# Altium project Oasis.PrjPcb
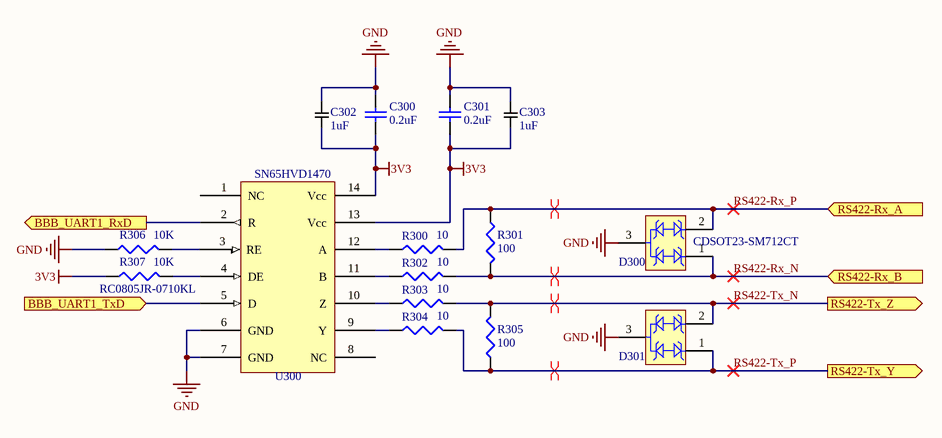
[diagram p0: 300_CDH_RS422.SchDoc]
6 sheets, 142 parts. Net scope: global (net labels, ports and power ports of the same name join across sheets).
Board file: CDH_PCB_reva02.PcbDoc
Sheets:
  300_CDH_RS422.SchDoc
  000_BBB_Pinouts.SchDoc
  100_POWER.SchDoc
  400_TEENSY.SchDoc
  500_HEATERS.SchDoc
  200_CDH_USB_2_Hub.SchDoc

## Sheet 300_CDH_RS422.SchDoc: RS422 Line Driver
size A; DrawnBy: Tyler Sengia; Engineer: Tyler Sengia; Organization: PSU Student Space Projects Lab; Revision: 1

### Parts
C300  value 0.2uF  [IMPERIAL0805_CAPACITOR]  (hidden comment: 0.2uF Capacitor)
C301  value 0.2uF  [IMPERIAL0805_CAPACITOR]  (hidden comment: 0.2uF Capacitor)
C302  value 1uF  [IMPERIAL0603_Capacitor]  (hidden comment: 1 uF Capacitor)
C303  value 1uF  [IMPERIAL0603_Capacitor]  (hidden comment: 1 uF Capacitor)
D300  Other Names: CDSOT23-SM712CT  [BOUR-SOT23-3_V]  (hidden comment: CDSOT23-SM712)
D301  CDSOT23-SM712  [BOUR-SOT23-3_V]  (value not drawn)
R300  value 10  [Imperial1206_RES]  (hidden comment: 10 Ohm Resistor)
R301  value 100  [Imperial0805_RES]  (hidden comment: 100 Ohm Resistor)
R302  value 10  [Imperial1206_RES]  (hidden comment: 10 Ohm Resistor)
R303  value 10  [Imperial1206_RES]  (hidden comment: 10 Ohm Resistor)
R304  value 10  [Imperial1206_RES]  (hidden comment: 10 Ohm Resistor)
R305  value 100  [Imperial0805_RES]  (hidden comment: 100 Ohm Resistor)
R306  value 10K  [Imperial0805_RES]  (hidden comment: RC0805JR-0710KL)
R307  RC0805JR-0710KL  value 10K  [Imperial0805_RES]
U300  Generic Part Number: SN65HVD1470  [SOIC127P590X175-14M]  (hidden comment: SN65HVD1470D)

### Ports
BBB_UART1_RxD (out), BBB_UART1_TxD (in), RS422-Rx_A (in), RS422-Rx_B (in), RS422-Tx_Y (out), RS422-Tx_Z (out)

### Nets
3V3: C300.1 C301.1 C302.1 C303.1 R307.1 U300.13(Vcc) U300.14(Vcc)
GND: C300.2 C301.2 C302.2 C303.2 D300.3 D301.3 R306.1 U300.6(GND) U300.7(GND)
RS422-Rx_N: D300.1 R301.2 R302.2 ; port RS422-Rx_B
RS422-Rx_P: D300.2 R300.2 R301.1 ; port RS422-Rx_A
RS422-Tx_N: D301.2 R303.2 R305.2 ; port RS422-Tx_Z
RS422-Tx_P: D301.1 R304.2 R305.1 ; port RS422-Tx_Y
NetR300_1: R300.1 U300.12(A)
NetR302_1: R302.1 U300.11(B)
NetR303_1: R303.1 U300.10(Z)
NetR304_1: R304.1 U300.9(Y)
NetR306_2: R306.2 U300.3(RE)
NetR307_2: R307.2 U300.4(DE)
NetU2_14: U300.5(D) ; port BBB_UART1_TxD
NetU2_15: U300.2(R) ; port BBB_UART1_RxD

Not connected (* = marked no-connect by the designer): U300 1(NC) 8(NC)

### Layout directives
differential pair; rule Impedance Constraint [Min = 90.00    Max = 110.0    ]: RS422-Rx_N, RS422-Rx_P, RS422-Tx_N, RS422-Tx_P

### Library data of the parts
C300 C301 = GCM219R71C204JA37J: Published: 8-Jun-2000; LatestRevisionDate: 29-May-2009; LatestRevisionNote: IPC-7351 Footprint Added.; PackageReference: C1206; Publisher: Altium Limited; PackageDescription: Chip Capacitor; Supplier 1: Mouser; Supplier Part Number 1: 81-GCM219R71C204JA7J
C302 C303 = TMK107BLD105KA-T: Supplier 1: Mouser; Supplier Part Number 1: 963-TMK107BLD105KA-T
D300 = CDSOT23-SM712: TVS Diode, 17 A Ipp, -55 to 150 degC, 3-Pin SOT23, RoHS, Tape and Reel; Manufacturer: Bourns; Catalog Drawings: CDSOT23-SM712Schematic; Current - Peak Pulse (10/1000µs): 17A(8/20µs); Voltage - Breakdown (Min): 7.5V,13.3V; Online Catalog: CDSOT23Series; Power Line Protection: No; Bidirectional Channels: 2; Type: Zener; For Use With: EVAL-CN0313-SDPZ-ND-EVALEMCRS-485CERTIFIED; Kits: PN-DESIGNKIT-22-ND-KITESD/EFTSURGEPROTECTION; Capacitance @ Frequency: 75pF@1MHz; Product Training Modules: ESDProtectionProducts; Voltage - Clamping (Max) @ Ipp: 14V,26V; Voltage - Reverse Standoff (Typ): 7V(Max),12V(Max); Related Products: ADM3485EARZ-REEL7TR-ND-ICTXRXRS-485HS3.3V8SOICADM3485EARZ-REEL7CT-ND-ICTXRXRS-485HS3.3V8SOICADM3485EARZ-REEL7DKR-ND-ICTXRXRS-485HS3.3V8SOICADM3485EARZ-ND-ICTX/RXRS-485HS3.3V8-SOICADM3485EAR-ND-ICTX/RXRS-485HS3.3V8-SOIC296-38503-5-ND-ICTXRXRS4853.3VESD14SOIC296-38501-5-ND-ICRS485TXRX3.3ESD8SOIC296-38522-5-ND-ICTXRXRS4853.3V14SOIC296-38502-5-ND-ICTXRXRS4853.3VESD14SOICADM3485EARZ-REELTR-ND-ICTXRXRS-4853.3V8SOICADM3485EARZ-REELCT-ND-ICTXRXRS-4853.3V8SOICADM3485EARZ-REELDKR-ND-ICTXRXRS-4853.3V8SOIC296-40517-2-ND-ICTXRXRS4853.3V14SOIC296-40517-1-ND-ICTXRXRS4853.3V14SOIC296-40517-6-ND-ICTXRXRS4853.3V14SOIC296-40519-2-ND-ICRS485TXRX3.3ESD8SOIC296-40519-1-ND-ICRS485TXRX3.3ESD8SOIC296-40519-6-ND-ICRS485TXRX3.3ESD8SOIC296-40524-2-ND-ICTXRXRS4853.3VESD8SOIC296-40524-1-ND-ICTXRXRS4853.3VESD8SOIC296-40524-6-ND-ICTXRXRS4853.3VESD8SOIC296-40522-2-ND-ICTXRXRS4853.3VESD14SOIC296-40522-1-ND-ICTXRXRS4853.3VESD14SOIC296-40522-6-ND-ICTXRXRS4853.3VESD14SOIC296-40529-2-ND-ICRS485TXRX3.3ESD8SOIC296-40529-1-ND-ICRS485TXRX3.3ESD8SOIC2; Power - Peak Pulse: 400W; Applications: GeneralPurpose; Supplier Device Package: SOT-23-3; Package / Case: TO-236-3,SC-59,SOT-23-3; Mounting Type: SurfaceMount; Datasheet URL: https://datasheet.ciiva.com/11193/cdsot23-sm712-11193846.pdf; Standard Package: 1; Series: -; Category: CircuitProtection; Unidirectional Channels: -; Package Description: 3-Lead Small Out-Line Transistor, Body 2.9x1.3mm, Pitch 0.95mm; Family: TVS-Diodes; Datasheet Version: Aug-12; Manufacturer URL: http://www.bourns.com/; Operating Temperature: -55degC~150degC(TJ); Packaging: CutTape(CT)
D301 = CDSOT23-SM712: TVS Diode, 17 A Ipp, -55 to 150 degC, 3-Pin SOT23, RoHS, Tape and Reel; Manufacturer: Bourns; Catalog Drawings: CDSOT23-SM712Schematic; Current - Peak Pulse (10/1000µs): 17A(8/20µs); Voltage - Breakdown (Min): 7.5V,13.3V; Online Catalog: CDSOT23Series; Power Line Protection: No; Bidirectional Channels: 2; Type: Zener; For Use With: EVAL-CN0313-SDPZ-ND-EVALEMCRS-485CERTIFIED; Kits: PN-DESIGNKIT-22-ND-KITESD/EFTSURGEPROTECTION; Capacitance @ Frequency: 75pF@1MHz; Product Training Modules: ESDProtectionProducts; Voltage - Clamping (Max) @ Ipp: 14V,26V; Voltage - Reverse Standoff (Typ): 7V(Max),12V(Max); Related Products: ADM3485EARZ-REEL7TR-ND-ICTXRXRS-485HS3.3V8SOICADM3485EARZ-REEL7CT-ND-ICTXRXRS-485HS3.3V8SOICADM3485EARZ-REEL7DKR-ND-ICTXRXRS-485HS3.3V8SOICADM3485EARZ-ND-ICTX/RXRS-485HS3.3V8-SOICADM3485EAR-ND-ICTX/RXRS-485HS3.3V8-SOIC296-38503-5-ND-ICTXRXRS4853.3VESD14SOIC296-38501-5-ND-ICRS485TXRX3.3ESD8SOIC296-38522-5-ND-ICTXRXRS4853.3V14SOIC296-38502-5-ND-ICTXRXRS4853.3VESD14SOICADM3485EARZ-REELTR-ND-ICTXRXRS-4853.3V8SOICADM3485EARZ-REELCT-ND-ICTXRXRS-4853.3V8SOICADM3485EARZ-REELDKR-ND-ICTXRXRS-4853.3V8SOIC296-40517-2-ND-ICTXRXRS4853.3V14SOIC296-40517-1-ND-ICTXRXRS4853.3V14SOIC296-40517-6-ND-ICTXRXRS4853.3V14SOIC296-40519-2-ND-ICRS485TXRX3.3ESD8SOIC296-40519-1-ND-ICRS485TXRX3.3ESD8SOIC296-40519-6-ND-ICRS485TXRX3.3ESD8SOIC296-40524-2-ND-ICTXRXRS4853.3VESD8SOIC296-40524-1-ND-ICTXRXRS4853.3VESD8SOIC296-40524-6-ND-ICTXRXRS4853.3VESD8SOIC296-40522-2-ND-ICTXRXRS4853.3VESD14SOIC296-40522-1-ND-ICTXRXRS4853.3VESD14SOIC296-40522-6-ND-ICTXRXRS4853.3VESD14SOIC296-40529-2-ND-ICRS485TXRX3.3ESD8SOIC296-40529-1-ND-ICRS485TXRX3.3ESD8SOIC2; Other Names: CDSOT23-SM712CT; Power - Peak Pulse: 400W; Applications: GeneralPurpose; Supplier Device Package: SOT-23-3; Package / Case: TO-236-3,SC-59,SOT-23-3; Mounting Type: SurfaceMount; Datasheet URL: https://datasheet.ciiva.com/11193/cdsot23-sm712-11193846.pdf; Standard Package: 1; Series: -; Category: CircuitProtection; Unidirectional Channels: -; Package Description: 3-Lead Small Out-Line Transistor, Body 2.9x1.3mm, Pitch 0.95mm; Family: TVS-Diodes; Datasheet Version: Aug-12; Manufacturer URL: http://www.bourns.com/; Operating Temperature: -55degC~150degC(TJ); Packaging: CutTape(CT)
R300 R302-R304 = SR732BTTE10R0F: 10 Ohm Resistor, RS-422 shockproof resistor; Published: 8-Jun-2000; LatestRevisionDate: 29-May-2009; LatestRevisionNote: IPC-7351 Footprint Added.; PackageReference: J1-0603; Publisher: Altium Limited; PackageDescription: Chip Resistor; Supplier 1: Mouser; Supplier Part Number 1: 660-SR732BTTE10R0F
R301 R305 = SR0805FR-47100RL: 100 Ohm resistor, RS422 Terminating Resistor; Published: 8-Jun-2000; LatestRevisionDate: 29-May-2009; LatestRevisionNote: IPC-7351 Footprint Added.; PackageReference: J1-0603; Publisher: Altium Limited; PackageDescription: Chip Resistor; Supplier 1: Digi-Key; Supplier Part Number 1: YAG5845CT-ND
R306 R307 = RC0805JR-0710KL: 10K resistor, 1/8W, 0805 Imperial; Manufacturer_Name: YAGEO (PHYCOMP); Datasheet Link: http://www.yageo.com/documents/recent/PYu-RC_Group_51_RoHS_L_10.pdf; Height: 0.6mm; Manufacturer_Part_Number: RC0805JR-0710KL
U300 = SN65HVD1470D: RS-422 line driver IC; Supplier 1: Digi-Key; Supplier Part Number 1: 296-40501-1-ND

## Sheet 000_BBB_Pinouts.SchDoc: Oasis Pinouts
size A; Revision: 1; SheetNumber: 1
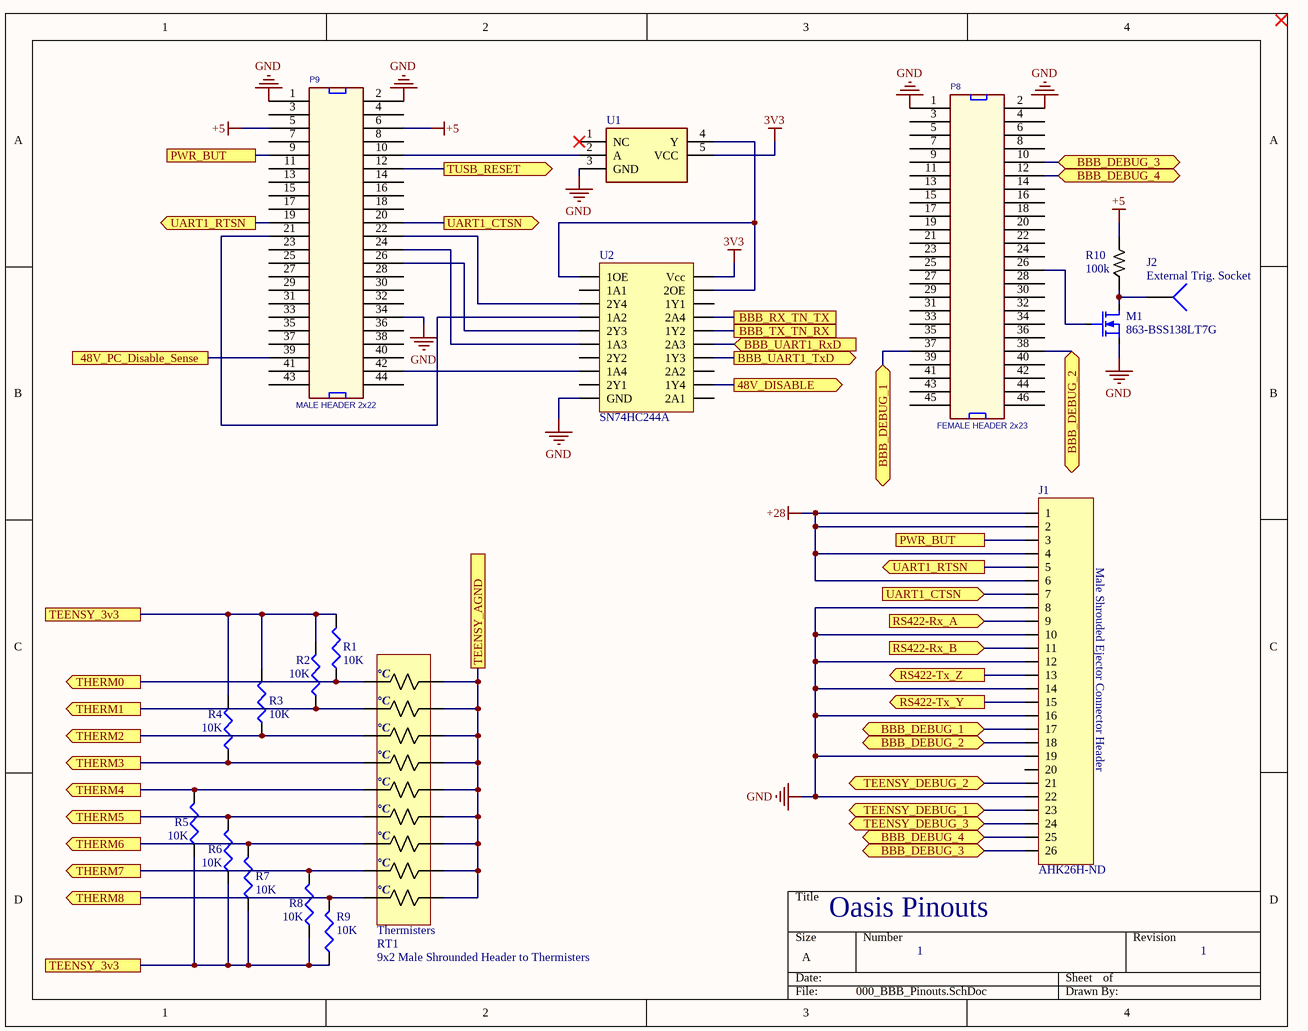
[diagram p1: 000_BBB_Pinouts.SchDoc]

### Parts
J1  Supplier Part Number 1: AHK26H-ND  [TE_5499922-6]  (hidden comment: TE_5499922-6)
J2  External Trig. Socket  [PIN1]
M1  Supplier Part Number 1: 863-BSS138LT7G  [SOT95P245X110-3N]  (hidden comment: BSS138LT7G)
P8  FEMALE HEADER 2x23  [MAJOR-TSHC-123-D-03_V_FLIPPED]
P9  MALE HEADER 2x22  [MAJOR-TSHC-123-D-03_V_TRIMMED]
R1  value 10K  [Imperial0603_RES]  (hidden comment: 10K Resistor)
R2  value 10K  [Imperial0603_RES]  (hidden comment: 10K Resistor)
R3  value 10K  [Imperial0603_RES]  (hidden comment: 10K Resistor)
R4  value 10K  [Imperial0603_RES]  (hidden comment: 10K Resistor)
R5  value 10K  [Imperial0603_RES]  (hidden comment: 10K Resistor)
R6  value 10K  [Imperial0603_RES]  (hidden comment: 10K Resistor)
R7  value 10K  [Imperial0603_RES]  (hidden comment: 10K Resistor)
R8  value 10K  [Imperial0603_RES]  (hidden comment: 10K Resistor)
R9  value 10K  [Imperial0603_RES]  (hidden comment: 10K Resistor)
R10  value 100k  [Imperial0603_RES]  (hidden comment: MCT06030E1003BP500)
RT1  NTC Thermister Array  [MOLEX 90130-1118]  (value not drawn)
U1  single gate inverter  [SOT65P210X110-5N]  (value not drawn)
U2  Tristate buffer  [SOP65P780X200-20N]  (value not drawn)

### Ports
48V_DISABLE (out), 48V_PC_Disable_Sense, BBB_DEBUG_1 (bidir), BBB_DEBUG_2 (bidir), BBB_DEBUG_3 (bidir), BBB_DEBUG_4 (bidir), BBB_RX_TN_TX, BBB_TX_TN_RX, BBB_UART1_RxD (in), BBB_UART1_TxD (out), PWR_BUT, RS422-Rx_A (in), RS422-Rx_B (in), RS422-Tx_Y (out), RS422-Tx_Z (out), TEENSY_3v3, TEENSY_AGND, TEENSY_DEBUG_1 (bidir), TEENSY_DEBUG_2 (bidir), TEENSY_DEBUG_3 (bidir), THERM0 (out), THERM1 (out), THERM2 (out), THERM3 (out), THERM4 (out), THERM5 (out), THERM6 (out), THERM7 (out), THERM8 (out), TUSB_RESET (out), UART1_CTSN (in), UART1_CTSN (out), UART1_RTSN (out)

### Nets
3V3: U1.5(VCC) U2.20(Vcc)
+5: P9.5 P9.6 R10.1
+28: J1.1 J1.2 J1.4 J1.6
GND: J1.8 J1.10 J1.12 J1.14 J1.16 J1.19 J1.22 M1.2(S) P8.1 P8.2 P9.1 P9.2 P9.34 U1.3(GND) U2.10(GND)
RS422-Rx_N: J1.11 ; port RS422-Rx_B
RS422-Rx_P: J1.9 ; port RS422-Rx_A
RS422-Tx_N: J1.13 ; port RS422-Tx_Z
RS422-Tx_P: J1.15 ; port RS422-Tx_Y
TN_3V3: R1.2 R2.2 R3.2 R4.2 R5.1 R6.2 R7.2 R8.2 R9.2 ; port TEENSY_3v3
NetC407_2: RT1.2 RT1.4 RT1.6 RT1.8 RT1.10 RT1.12 RT1.14 RT1.16 RT1.18 ; port TEENSY_AGND
NetJ1_3: J1.3 P9.9 ; port PWR_BUT
NetJ1_5: J1.5 P9.19 ; port UART1_RTSN
NetJ1_7: J1.7 P9.20 ; port UART1_CTSN
NetJ1_17: J1.17 P8.37 ; port BBB_DEBUG_1
NetJ1_18: J1.18 P8.38 ; port BBB_DEBUG_2
NetJ1_21: J1.21 ; port TEENSY_DEBUG_2
NetJ1_23: J1.23 ; port TEENSY_DEBUG_1
NetJ1_24: J1.24 ; port TEENSY_DEBUG_3
NetJ1_25: J1.25 P8.12 ; port BBB_DEBUG_4
NetJ1_26: J1.26 P8.10 ; port BBB_DEBUG_3
NetJ2_1: J2.1 M1.3(D) R10.2
NetM1_1: M1.1(G) P8.26
NetM103_1: U2.12(1Y4) ; port 48V_DISABLE
NetP9_10: P9.10 U1.2(A)
NetP9_12: P9.12 ; port TUSB_RESET
NetP9_21: P9.21 U2.4(1A2)
NetP9_22: P9.22 U2.3(2Y4)
NetP9_24: P9.24 U2.6(1A3)
NetP9_26: P9.26 U2.5(2Y3)
NetP9_39: P9.39 ; port 48V_PC_Disable_Sense
NetP9_42: P9.42 U2.8(1A4)
NetR1_1: R1.1 RT1.1 ; port THERM0
NetR2_1: R2.1 RT1.3 ; port THERM1
NetR3_1: R3.1 RT1.5 ; port THERM2
NetR4_1: R4.1 RT1.7 ; port THERM3
NetR5_2: R5.2 RT1.9 ; port THERM4
NetR6_1: R6.1 RT1.11 ; port THERM5
NetR7_1: R7.1 RT1.13 ; port THERM6
NetR8_1: R8.1 RT1.15 ; port THERM7
NetR9_1: R9.1 RT1.17 ; port THERM8
NetU1_4: U1.4(Y) U2.1(1OE) U2.19(2OE)
NetU2_14: U2.14(1Y3) ; port BBB_UART1_TxD
NetU2_15: U2.15(2A3) ; port BBB_UART1_RxD
NetU2_16: U2.16(1Y2) ; port BBB_TX_TN_RX
NetU2_17: U2.17(2A4) ; port BBB_RX_TN_TX

Not connected (* = marked no-connect by the designer): J1 20; P8 3(2) 4(27) 5(3) 6(28) 7(4) 8(29) 9(5) 11(6) 13(7) 14(32) 15(8) 16(33) 17(9) 18(34) 19(10) 20(35) 21(11) 22(36) 23(12) 24(37) 25(13) 27(14) 28(39) 29(15) 30(40) 31(16) 32(41) 33(17) 34(42) 35(18) 36(43) 39(20) 40(45) 41(21) 42(46) 43(22) 44(47) 45(23) 46(48); P9 3(2) 4(27) 7(4) 8(29) 11(6) 13(7) 14(32) 15(8) 16(33) 17(9) 18(34) 23(12) 25(13) 27(14) 28(39) 29(15) 30(40) 31(16) 32(41) 33(17) 35(18) 36(43) 37(19) 38(44) 40(45) 41(21) 43(22) 44(47); U1 1(NC)*; U2 2(1A1) 7(2Y2) 9(2Y1) 11(2A1) 13(2A2) 18(1Y1)

### Notes on the sheet
- Male Shrouded Ejector Connector Header
- 9x2 Male Shrounded Header to Thermisters
- (in symbol Thermisters) °C

### Library data of the parts
J1 = TE_5499922-6: AMP-LATCH Universal Headers - 26 Pos; Supplier 1: Digi-Key
J2 = Socket: LatestRevisionDate: 17-Jul-2002; LatestRevisionNote: Re-released for DXP Platform.; Publisher: Altium Limited
M1 = BSS138LT7G: N-MOSFET for logic level switching; Supplier 1: Mouser
P8 = HDR_46_F_2_0.1_0.1: 2x23 Female Pin header, 2.54mm, gold plated; Manufacturer: Sullins Connector Solutions; Manufacturer Part Number: PPPC232LFBN-RC; Number of Positions: 46; Number of Positions Loaded: All; Pitch: 0.100" (2.54mm); Supplier 1: Digi-Key; Supplier Part Number 1: SAM1196-23-ND; RoHS: RoHS Compliant; Category: Connectors, Interconnects; Stock 1: 750; Pricing 1: 1=2.75, 10=2.325, 25=2.2196, 50=2.0084, 100=1.7969, 250=1.58552, 500=1.4798, 1000=1.3741, 2500=1.32125 (USD); Connector Type: Header; Contact Type: Female Socket; Number of Rows: 2; Row Spacing: 0.100" (2.54mm); Mounting Type: Through Hole; Termination: Solder; Fastening Type: -; Features: -; Contact Finish: Gold; Contact Finish Thickness: Flash; Color: Black; Packaging: Bulk; ComponentLink1URL: http://www.sullinscorp.com/drawings/78_P(N)PxCxxxLFBN-RC,_10492-G.pdf; ComponentLink1Description: http://www.sullinscorp.com/drawings/78_P(N)PxCxxxLFBN-RC,_10492-G.pdf
P9 = HDR_44_M_TRIMMED: 2x22 Male Pin header, 2.54mm, gold plated; Manufacturer: Sullins Connector Solutions; Manufacturer Part Number: PPPC232LFBN-RC; Number of Positions: 46; Number of Positions Loaded: All; Pitch: 0.100" (2.54mm); Supplier 1: Digi-Key; Supplier Part Number 1: SAM1196-23-ND; RoHS: RoHS Compliant; Category: Connectors, Interconnects; Stock 1: 750; Pricing 1: 1=2.75, 10=2.325, 25=2.2196, 50=2.0084, 100=1.7969, 250=1.58552, 500=1.4798, 1000=1.3741, 2500=1.32125 (USD); Connector Type: Header; Contact Type: Female Socket; Number of Rows: 2; Row Spacing: 0.100" (2.54mm); Mounting Type: Through Hole; Termination: Solder; Fastening Type: -; Features: -; Contact Finish: Gold; Contact Finish Thickness: Flash; Color: Black; Packaging: Bulk; ComponentLink1URL: http://www.sullinscorp.com/drawings/78_P(N)PxCxxxLFBN-RC,_10492-G.pdf; ComponentLink1Description: http://www.sullinscorp.com/drawings/78_P(N)PxCxxxLFBN-RC,_10492-G.pdf
R1-R9 = RN731JTTD1002F10: 10K resistor, Thermister Pullup Resistor; Published: 8-Jun-2000; LatestRevisionDate: 29-May-2009; LatestRevisionNote: IPC-7351 Footprint Added.; PackageReference: J1-0603; Publisher: Altium Limited; PackageDescription: Chip Resistor; Supplier 1: Mouser; Supplier Part Number 1: 660-RN731JTTD1002F10
R10 = MCT06030E1003BP500: 100 kOhm Resistor; Supplier 1: Mouser; Supplier Part Number 1: 594-MCT06030E1003BP5
RT1 = Thermisters: NTC Thermisters to monitor temperature of box. On PCB this will be a pin header.
U1 = SN74AHC1G14DCK3: Inverter, single gate; Manufacturer_Name: Texas Instruments; Datasheet Link: https://www.arrow.com/en/products/sn74ahc1g14dck3/texas-instruments; Height: 1.1mm; Manufacturer_Part_Number: SN74AHC1G14DCK3
U2 = SN74HC244A: Tristate buffer for protecting the BBB during power down.; Supplier 1: Mouser; Supplier Part Number 1: 595-SN74HC244APWR; IC Family: SN74HC244A

## Sheet 100_POWER.SchDoc: Power Regulation
size A; Revision: 1; SheetNumber: 1
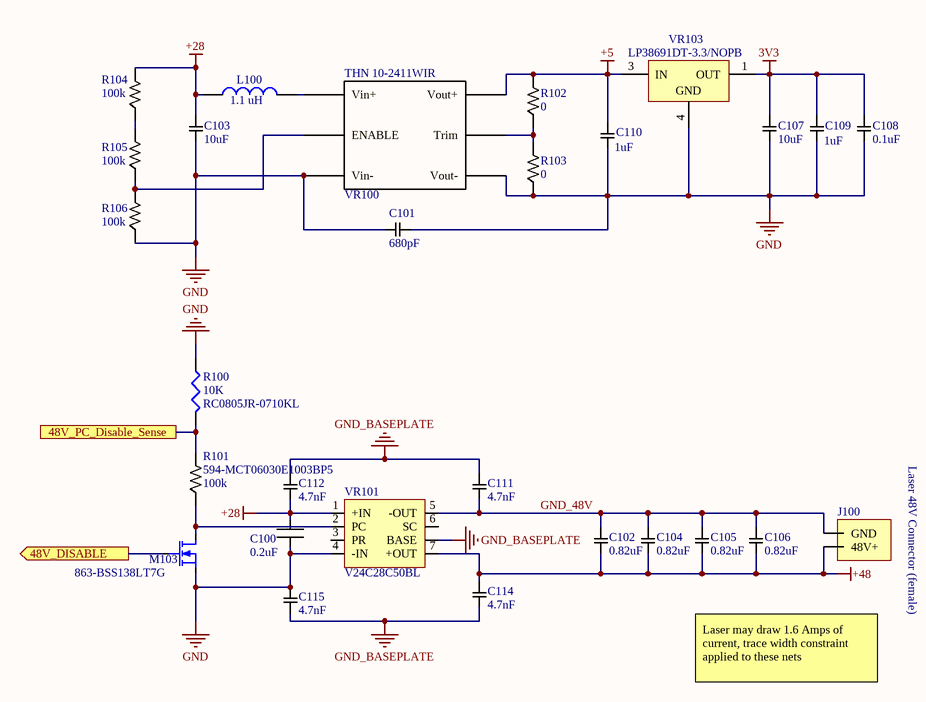
[diagram p2: 100_POWER.SchDoc]

### Parts
C100  value 0.2uF  [CAA572C0G2J204J640LH]  (hidden comment: 0.2uF Capactor, high voltage)
C101  value 680pF  [Imperial1808_CAP]  (hidden comment: 680pF Cap)
C102  value 0.82uF  [IMPERIAL1206_CAPACITOR]  (hidden comment: C1206X824J1RACAUTO)
C103  value 10uF  [Imperial1210_Cap]  (hidden comment: 10uF Capacitor)
C104  value 0.82uF  [IMPERIAL1206_CAPACITOR]  (hidden comment: C1206X824J1RACAUTO)
C105  value 0.82uF  [IMPERIAL1206_CAPACITOR]  (hidden comment: C1206X824J1RACAUTO)
C106  value 0.82uF  [IMPERIAL1206_CAPACITOR]  (hidden comment: C1206X824J1RACAUTO)
C107  value 10uF  [IMPERIAL1206_CAPACITOR]  (hidden comment: C1206X106K8RACAUTO)
C108  value 0.1uF  [IMPERIAL0603_Capacitor]  (hidden comment: 0.1uF Capacitor)
C109  value 1uF  [IMPERIAL0603_Capacitor]  (hidden comment: 1 uF Capacitor)
C110  value 1uF  [IMPERIAL0603_Capacitor]  (hidden comment: 1 uF Capacitor)
C111  value 4.7nF  [IMPERIAL0603_Capacitor]  (hidden comment: 4.7nF Capacitor)
C112  value 4.7nF  [IMPERIAL0603_Capacitor]  (hidden comment: 4.7nF Capacitor)
C114  value 4.7nF  [IMPERIAL0603_Capacitor]  (hidden comment: 4.7nF Capacitor)
C115  value 4.7nF  [IMPERIAL0603_Capacitor]  (hidden comment: 4.7nF Capacitor)
J100  LaserHeader  [MOLEX 2X1 LATCH HEADER]  (value not drawn)
L100  value 1.1 uH  [XAL6020-112ME_]  (hidden comment: 1.1uH Inductor)
M103  Supplier Part Number 1: 863-BSS138LT7G  [SOT95P245X110-3N]  (hidden comment: BSS138LT7G)
R100  RC0805JR-0710KL  value 10K  [Imperial0805_RES]
R101  value 100k  Supplier Part Number 1: 594-MCT06030E1003BP5  [Imperial0603_RES]  (hidden comment: MCT06030E1003BP500)
R102  value 0  [Imperial0603_RES]  (hidden comment: 0 Ohm Link)
R103  value 0  [Imperial0603_RES]  (hidden comment: 0 Ohm Link)
R104  value 100k  [Imperial0603_RES]  (hidden comment: MCT06030E1003BP500)
R105  value 100k  [Imperial0603_RES]  (hidden comment: MCT06030E1003BP500)
R106  value 100k  [Imperial0603_RES]  (hidden comment: MCT06030E1003BP500)
VR100  28 to 5V switching converter  [THN 30-2411WI-A1]  (value not drawn)
VR101  V24C28C50BL  [V24C48C50BL_tht]
VR103  LP38691DT-3.3/NOPB  [NDP0003B_N]

### Ports
48V_DISABLE (out), 48V_PC_Disable_Sense

### Nets
3V3: C107.2 C108.2 C109.2 VR103.1(OUT)
+5: C110.2 R102.1 VR100.3(Vout+) VR103.3(IN)
+28: C100.2 C103.2 C112.1 L100.1 R104.1 VR101.1(+IN)
+48: C102.1 C104.1 C105.1 C106.1 C114.2 J100.1(48V+) VR101.7(+OUT)
GND: C100.1 C101.1 C101.2 C103.1 C107.1 C108.1 C109.1 C110.1 C115.1 M103.2(S) R100.1 R103.2 R106.2 VR100.2(Vin-) VR100.5(Vout-) VR101.4(-IN) VR103.4(GND)
GND_BASEPLATE: C111.2 C112.2 C114.1 C115.2 VR101.BASE
GND_48V: C102.2 C104.2 C105.2 C106.2 C111.1 J100.2(GND) VR101.5(-OUT)
NetL100_2: L100.2 VR100.1(Vin+)
NetM103_1: M103.1(G) ; port 48V_DISABLE
NetM103_3: M103.3(D) R101.2 VR101.2(PC)
NetP9_39: R100.2 R101.1 ; port 48V_PC_Disable_Sense
NetR102_2: R102.2 R103.1 VR100.4(Trim)
NetR104_2: R104.2 R105.1
NetR105_2: R105.2 R106.1 VR100.6(ENABLE)

Not connected (* = marked no-connect by the designer): VR101 3(PR) 6(SC)

### Notes on the sheet
- Laser may draw 1.6 Amps of current, trace width constraint applied to these nets
- (in symbol LaserHeader) Laser 48V Connector (female)

### Library data of the parts
C100 = CAA572C0G2J204J640LH: 0.2uF capacitor, high voltage; Supplier 1: Digi-Key; Supplier Part Number 1: 445-180360-1-ND
C101 = C1808C681KHRACTU: 680pF Cap for EMI suppresion on 5V regulator; Supplier 1: Mouser; Supplier Part Number 1: 80-C1808C681KHR
C102 C104-C106 = C1206X824J1RACAUTO: 0.82 uF Capacitor for creating output capacitance on 48V converter; Manufacturer: KEMET; Manufacturer Part Number: C1206X824J1RACAUTO
C103 = CNA6P1X7R1H106K250AE: 10 uF Capacitor for EMI supression on 5V regulator; Supplier Part Number: C2012X8L1A106K125AE; Supplier 1: Mouser; Supplier Part Number 1: 810-CNA6P1X7R1H106K2
C107 = C1206X106K8RACAUTO: 10 uF Capacitor, non-polar; Manufacturer: KEMET; Manufacturer Part Number: C1206X106K8RACAUTO
C108 = VJ0603Y104MXQPW1BC: 0.1uF Capacitor, Non Polarized Chip Cap; Supplier 1: Mouser; Supplier Part Number 1: 963-LMK107BJ225KK-T
C109 C110 = TMK107BLD105KA-T: Supplier 1: Mouser; Supplier Part Number 1: 963-TMK107BLD105KA-T
C111 C112 C114 C115 = CGA3E2X8R2A472K080AE: 4.7nF soft terminated MLCC capacitor for 48V emi filtering; Supplier 1: Mouser; Supplier Part Number 1: 810-CGA3E2X8R2A472KA
J100 = LaserHeader: 2 pin molex connector for connecting laser to 48Vdc
L100 = XAL6020-112MEB: 1.1uH inductor for EMI suppresion on 5V regulator; Supplier 1: Mouser; Supplier Part Number 1: 994-XAL6020-112MEB
M103 = BSS138LT7G: N-MOSFET for logic level switching; Supplier 1: Mouser
R100 = RC0805JR-0710KL: as R306 on sheet 300_CDH_RS422; Datasheet Link: http://www.yageo.com/documents/recent/PYu-RC_Group_51_RoHS_L_10.pdf; Height: 0.6mm; Manufacturer_Part_Number: RC0805JR-0710KL
R101 R104-R106 = MCT06030E1003BP500: 100 kOhm Resistor; Supplier 1: Mouser
  R104-R106: Supplier Part Number 1: 594-MCT06030E1003BP5
R102 R103 = 0_Ohm_Link: Placeholder 0 Ohm Link.
VR100 = THN 10-2411WIR: 28V to 5V converter; Supplier 1: Digi-Key; Manufacture Part No: THN 10-2411WIR; ComponentLink1Description: Datasheet; ComponentLink1URL: https://www.mouser.com/datasheet/2/687/thn10wir-datasheet-1695877.pdf
VR101 = V24C28C50BL: 28V to 48V converter, 50W; Supplier 1: Mouser; Supplier Part Number 1: 492-V24C48C50BL
VR103 = CMP-0062-00443-4: 3.3V 500mA Low Dropout CMOS Linear Regulators Stable with Ceramic Output Capacitors, 3-pin TO-252, Pb-Free, 75 Rail; Manufacturer: Texas Instruments; CompType: LDO IC; PowerWise: Y; PackageTopMarking: NSUZXYTT*LP38691*DT-3.3; PackageDescription: TO252, Molded, Jedec, 6.8 x 6.10 x 2.30mm Body, 3 Lead, 2.28mm Pitch, Surface Mount; PackageReference: NDP0003B; ComponentLink1Description: Datasheet URL; RoHS: Y; PartNumber: LP38691DT-3.3/NOPB; PinCount: 3; ComponentLink1URL: http://www.ti.com/general/docs/lit/getliterature.tsp?genericPartNumber=LP38691&fileType=pdf; Code_JEDEC: TO-252-AA; High-Reliability: Y

## Sheet 400_TEENSY.SchDoc: Thermal Logic Controller
size A; Revision: 1; SheetNumber: 1
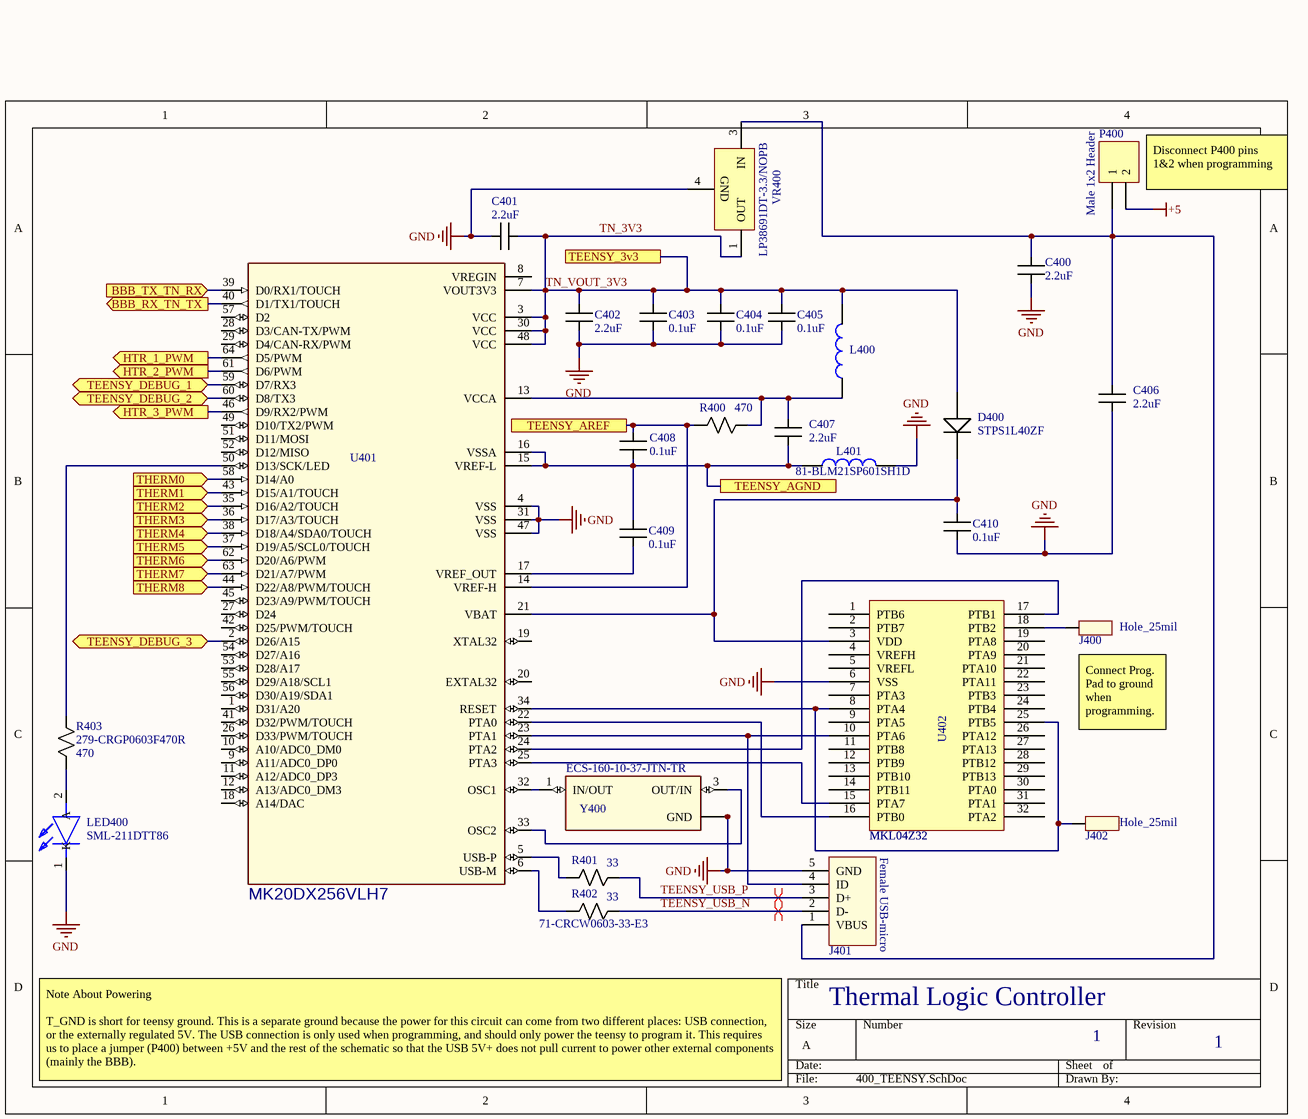
[diagram p3: 400_TEENSY.SchDoc]

### Parts
C400  value 2.2uF  [IMPERIAL0603_Capacitor]  (hidden comment: 2.2uF Capacitor)
C401  value 2.2uF  [IMPERIAL0603_Capacitor]  (hidden comment: 2.2uF Capacitor)
C402  value 2.2uF  [IMPERIAL0603_Capacitor]  (hidden comment: 2.2uF Capacitor)
C403  value 0.1uF  [IMPERIAL0603_Capacitor]  (hidden comment: 0.1uF Capactor)
C404  value 0.1uF  [IMPERIAL0603_Capacitor]  (hidden comment: 0.1uF Capactor)
C405  value 0.1uF  [IMPERIAL0603_Capacitor]  (hidden comment: 0.1uF Capactor)
C406  value 2.2uF  [IMPERIAL0603_Capacitor]  (hidden comment: 2.2uF Capacitor)
C407  value 2.2uF  [IMPERIAL0603_Capacitor]  (hidden comment: 2.2uF Capacitor)
C408  value 0.1uF  [IMPERIAL0603_Capacitor]  (hidden comment: 0.1uF Capactor)
C409  value 0.1uF  [IMPERIAL0603_Capacitor]  (hidden comment: 0.1uF Capactor)
C410  value 0.1uF  [IMPERIAL0603_Capacitor]  (hidden comment: 0.1uF Capactor)
D400  STPS1L40ZF  [*SODFL3718X108N]
J400  Hole_25mil  [PAD_40x25]
J401  uUSB Padsonly  [uUSB_Padsonly]  (value not drawn)
J402  Hole_25mil  [PAD_40x25]
L400  Supplier Part Number 1: 81-BLM21SP601SH1D  [Imperial0805_RES]  (hidden comment: Ferritde, 600 Ohm Impedence)
L401  Ferritde, 600 Ohm Impedence  [Imperial0805_RES]  (value not drawn)
LED400  SML-211DTT86  [LEDC2012X90N]
P400  Header 2  [HDR1X2]  (value not drawn)
R400  value 470  [Imperial0603_RES]  (hidden comment: 470 Ohm Resistor)
R401  value 33  [Imperial0603_RES]  (hidden comment: 33 Ohm Resistor)
R402  value 33  Supplier Part Number 1: 71-CRCW0603-33-E3  [Imperial0603_RES]  (hidden comment: 33 Ohm Resistor)
R403  value 470  Supplier Part Number 1: 279-CRGP0603F470R  [Imperial0603_RES]  (hidden comment: 470 Ohm Resistor)
U401  MK20DX256VLH7  [*QFP50P1200X1200X160-64N]
U402  MKL04Z32  [*QFP80P900X900X160-32N]
VR400  LP38691DT-3.3/NOPB  [NDP0003B_N]
Y400  ECS-160-10-37-JTN-TR  [XTAL_ECS-160-10-37-RWM-TR]

### Ports
BBB_RX_TN_TX (out), BBB_TX_TN_RX (in), HTR_1_PWM (out), HTR_2_PWM (out), HTR_3_PWM (out), TEENSY_3v3, TEENSY_AGND, TEENSY_AREF, TEENSY_DEBUG_1 (bidir), TEENSY_DEBUG_2 (bidir), TEENSY_DEBUG_3 (bidir), THERM0 (in), THERM1 (in), THERM2 (in), THERM3 (in), THERM4 (in), THERM5 (in), THERM6 (in), THERM7 (in), THERM8 (in)

### Nets
+5: P400.2
GND: C400.2 C401.2 C402.2 C403.2 C404.2 C405.2 C406.2 C410.2 J401.5(GND) L401.2 LED400.1(K) U401.4(VSS) U401.31(VSS) U401.47(VSS) U402.6(VSS) VR400.4(GND) Y400.2(GND) Y400.4(GND)
TEENSY_USB_N: J401.2(D-) R402.2
TEENSY_USB_P: J401.3(D+) R401.2
TN_3V3: C401.1 C402.1 C403.1 C404.1 C405.1 D400.2(anode) L400.2 U401.3(VCC) U401.7(VOUT3V3) U401.30(VCC) U401.48(VCC) VR400.1(OUT) ; port TEENSY_3v3  [also labelled TN_VOUT_3V3]
NetC400_1: C400.1 C406.1 J401.1(VBUS) P400.1 VR400.3(IN)
NetC407_1: C407.1 L400.1 R400.2 U401.13(VCCA)
NetC407_2: C407.2 C408.2 C409.1 L401.1 U401.15(VREF-L) U401.16(VSSA) ; port TEENSY_AGND
NetC408_1: C408.1 R400.1 U401.14(VREF-H) ; port TEENSY_AREF
NetC409_2: C409.2 U401.17(VREF_OUT)
NetC410_1: C410.1 D400.1(cathode) U401.21(VBAT) U402.3(VDD)
NetJ1_21: U401.60(D8/TX3) ; port TEENSY_DEBUG_2
NetJ1_23: U401.59(D7/RX3) ; port TEENSY_DEBUG_1
NetJ1_24: U401.2(D26/A15) ; port TEENSY_DEBUG_3
NetJ400_1: J400.1(PIN) U402.18(PTB2)
NetJ401_4: J401.4(ID) U401.23(PTA1) U402.10(PTA6)
NetJ402_1: J402.1(PIN) U401.34(RESET) U402.8(PTA4) U402.25(PTB5)
NetLED400_2: LED400.2(A) R403.1
NetR1_1: U401.58(D14/A0) ; port THERM0
NetR2_1: U401.43(D15/A1/TOUCH) ; port THERM1
NetR3_1: U401.35(D16/A2/TOUCH) ; port THERM2
NetR4_1: U401.36(D17/A3/TOUCH) ; port THERM3
NetR5_2: U401.38(D18/A4/SDA0/TOUCH) ; port THERM4
NetR6_1: U401.37(D19/A5/SCL0/TOUCH) ; port THERM5
NetR7_1: U401.62(D20/A6/PWM) ; port THERM6
NetR8_1: U401.63(D21/A7/PWM) ; port THERM7
NetR9_1: U401.44(D22/A8/PWM/TOUCH) ; port THERM8
NetR401_1: R401.1 U401.5(USB-P)
NetR402_1: R402.1 U401.6(USB-M)
NetR403_2: R403.2 U401.50(D13/SCK/LED)
NetU2_16: U401.39(D0/RX1/TOUCH) ; port BBB_TX_TN_RX
NetU2_17: U401.40(D1/TX1/TOUCH) ; port BBB_RX_TN_TX
NetU401_22: U401.22(PTA0) U402.16(PTB0)
NetU401_24: U401.24(PTA2) U402.17(PTB1)
NetU401_25: U401.25(PTA3) U402.15(PTA7)
NetU401_32: U401.32(OSC1) Y400.1(IN/OUT)
NetU401_33: U401.33(OSC2) Y400.3(OUT/IN)
NetU401_46: U401.46(D9/RX2/PWM) ; port HTR_3_PWM
NetU401_61: U401.61(D6/PWM) ; port HTR_2_PWM
NetU401_64: U401.64(D5/PWM) ; port HTR_1_PWM

Not connected (* = marked no-connect by the designer): U401 1(D31/A20) 8(VREGIN) 9(A11/ADC0_DP0) 10(A10/ADC0_DM0) 11(A12/ADC0_DP3) 12(A13/ADC0_DM3) 18(A14/DAC) 19(XTAL32) 20(EXTAL32) 26(D33/PWM/TOUCH) 27(D24) 28(D3/CAN-TX/PWM) 29(D4/CAN-RX/PWM) 41(D32/PWM/TOUCH) 42(D25/PWM/TOUCH) 45(D23/A9/PWM/TOUCH) 49(D10/TX2/PWM) 51(D11/MOSI) 52(D12/MISO) 53(D28/A17) 54(D27/A16) 55(D29/A18/SCL1) 56(D30/A19/SDA1) 57(D2); U402 1(PTB6) 2(PTB7) 4(VREFH) 5(VREFL) 7(PTA3) 9(PTA5) 11(PTB8) 12(PTB9) 13(PTB10) 14(PTB11) 19(PTA8) 20(PTA9) 21(PTA10) 22(PTA11) 23(PTB3) 24(PTB4) 26(PTA12) 27(PTA13) 28(PTB12) 29(PTB13) 30(PTA0) 31(PTA1) 32(PTA2)

### Layout directives
differential pair; rule Impedance Constraint [Min = 40.50    Max = 49.50    ]: TEENSY_USB_N, TEENSY_USB_P

### Notes on the sheet
- (near P400) Disconnect P400 pins 1&2 when programming
- (near P400) Male 1x2 Header
- (near J400) Connect Prog. Pad to ground when programming.
- Female USB-micro
- Note About Powering
  T_GND is short for teensy ground. This is a separate ground because the power for this circuit can come from two different places: USB connection, or the externally regulated 5V. The USB connection is only used when programming, and should only power the teensy to program it. This requires us to place a jumper (P400) between +5V and the rest of the schematic so that the USB 5V+ does not pull current to power other external components (mainly the BBB).

### Library data of the parts
C400-C402 C406 C407 = LMK107BJ225KK-T: 2.2uF Capacitor, Non Polarized Chip Cap; Supplier 1: Mouser; Supplier Part Number 1: 963-LMK107BJ225KK-T
C403-C405 C408-C410 = TMK107BJ104KA-T: 0.1uF capacitor, Non Polarized Chip Cap; Supplier 1: Mouser; Supplier Part Number 1: 963-TMK107BJ104KA-T
D400 = STPS1L40ZF: 1A Schottky Diode; pin to pad: 1>C 2>A; Supplier 1: Mouser; Supplier Part Number 1: 511-STPS1L40ZF
J400 J402 = Hole_25mil: 40 mil solder pad - 25 mil hole; Value: DNI
J401 = uUSB_Padsonly: Micro USB Connection - solder pads only; Value: DNI; Supplier 1: Mouser; Supplier Part Number 1: 710-629105150921
L400 L401 = BLM21SP601SH1D: Ferrite Bead, 600 Ohm Impedence for TLC; Value: 600 Ohm; Supplier 1: Mouser
  L401: Supplier Part Number 1: 81-BLM21SP601SH1D
LED400 = SML-211DTT86: LED; Manufacturer_Name: ROHM Semiconductor; Height: 0.9mm; Manufacturer_Part_Number: SML-211DTT86
P400 = Header 2: Header, 2-Pin; LatestRevisionDate: 17-Jul-2002; LatestRevisionNote: Re-released for DXP Platform.; Publisher: Altium Limited
R400 R403 = CRGP0603F470R: 470 Ohm Generic Chip Resistor; Supplier 1: Mouser
  R400: Supplier Part Number 1: 279-CRGP0603F470R
R401 R402 = CRCW060333R0FKEAC: 33 Ohm Generic Chip Resistor; Supplier 1: Mouser
  R401: Supplier Part Number 1: 71-CRCW0603-33-E3
U401 = MK20DX256VLH7: MCU 32-bit Kinetis K20 ARM Cortex M4 RISC 256KB Flash 1.8V/2.5V/3.3V 64-Pin LQFP Tray; MF: NXP USA; Package: LQFP-64 Freescale Semiconductor; Price: None; MP: MK20DX256VLH7; Availability: Unavailable; SnapEDA_Link: https://www.snapeda.com/parts/MK20DX256VLH7/NXP%20USA%20Inc./view-part/?ref=snap; Value: *; Supplier 1: Mouser; Supplier Part Number 1: 841-MK20DX256VLH7
U402 = MKL04Z32: Bootloader chip for teensy 3.2; Part Number: MKL04Z32
VR400 = CMP-0062-00443-4: as VR103 on sheet 100_POWER; PackageDescription: TO252, Molded, Jedec, 6.8 x 6.10 x 2.30mm Body, 3 Lead, 2.28mm Pitch, Surface Mount; PackageReference: NDP0003B; ComponentLink1Description: Datasheet URL; RoHS: Y; PartNumber: LP38691DT-3.3/NOPB; PinCount: 3; ComponentLink1URL: http://www.ti.com/general/docs/lit/getliterature.tsp?genericPartNumber=LP38691&fileType=pdf; Code_JEDEC: TO-252-AA; High-Reliability: Y
Y400 = ECS-160-10-37-JTN-TR: Crystal 16MHz; MF: ECS Inc.; Package: SMD-4 ECS International; MP: ECS-160-10-37-JTN-TR; Digi-Key_Purchase_URL: https://www.digikey.com/product-detail/en/ecs-inc/ECS-160-10-37-RWM-TR/XC2119CT-ND/5875603?utm_source=snapeda&utm_medium=aggregator&utm_campaign=symbol; Digi-Key_Part_Number: XC2119CT-ND; SnapEDA_Link: https://www.snapeda.com/parts/ECS-160-10-37-RWM-TR/ECS%20Inc./view-part/?ref=snap; Value: *; Supplier 1: Mouser; Supplier Part Number 1: 520-160-10-37-RWM-T

## Sheet 500_HEATERS.SchDoc: Heater Control
size A; Revision: 1; SheetNumber: 1
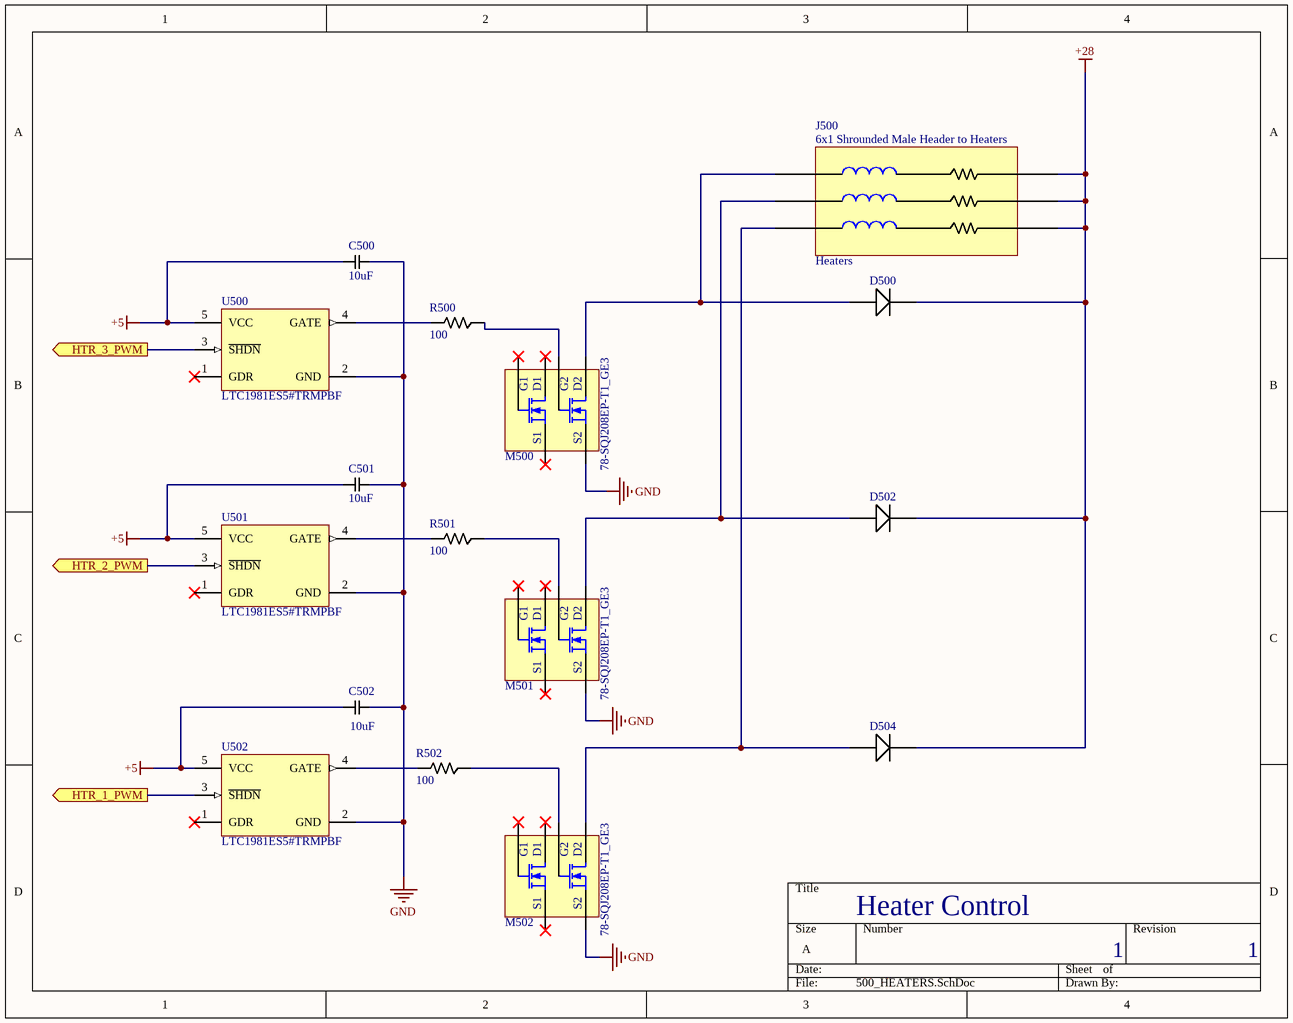
[diagram p4: 500_HEATERS.SchDoc]

### Parts
C500  value 10uF  [IMPERIAL0805_CAPACITOR]  (hidden comment: 10uF Capacitor)
C501  value 10uF  [IMPERIAL0805_CAPACITOR]  (hidden comment: 10uF Capacitor)
C502  value 10uF  [IMPERIAL0805_CAPACITOR]  (hidden comment: 10uF Capacitor)
D500  STPS1L40ZF  [*SODFL3718X108N]  (value not drawn)
D502  STPS1L40ZF  [*SODFL3718X108N]  (value not drawn)
D504  STPS1L40ZF  [*SODFL3718X108N]  (value not drawn)
J500  HeaterConnector  [MOLEX 6x1 latch header]  (value not drawn)
M500  Supplier Part Number 1: 78-SQJ208EP-T1_GE3  [PowerPAK SO-8L DUAL ASYMMETRIC]  (hidden comment: NPN MOSFET)
M501  Supplier Part Number 1: 78-SQJ208EP-T1_GE3  [PowerPAK SO-8L DUAL ASYMMETRIC]  (hidden comment: NPN MOSFET)
M502  Supplier Part Number 1: 78-SQJ208EP-T1_GE3  [PowerPAK SO-8L DUAL ASYMMETRIC]  (hidden comment: NPN MOSFET)
R500  value 100  [Imperial0603_RES]  (hidden comment: CRCW0603100RFKEAC)
R501  value 100  [Imperial0603_RES]  (hidden comment: CRCW0603100RFKEAC)
R502  value 100  [Imperial0603_RES]  (hidden comment: CRCW0603100RFKEAC)
U500  LTC1981ES5#TRMPBF  [LT-S5-5-SOT-23_M]
U501  LTC1981ES5#TRMPBF  [LT-S5-5-SOT-23_M]
U502  LTC1981ES5#TRMPBF  [LT-S5-5-SOT-23_M]

### Ports
HTR_1_PWM (out), HTR_2_PWM (out), HTR_3_PWM (out)

### Nets
+5: C500.2 C501.2 C502.2 U500.5(VCC) U501.5(VCC) U502.5(VCC)
+28: D500.1(cathode) D502.1(cathode) D504.1(cathode) J500.2 J500.4 J500.6
GND: C500.1 C501.1 C502.1 M500.S2 M501.S2 M502.S2 U500.2(GND) U501.2(GND) U502.2(GND)
NetD500_2: D500.2(anode) J500.1 M500.D2
NetD502_2: D502.2(anode) J500.3 M501.D2
NetD504_2: D504.2(anode) J500.5 M502.D2
NetM500_G2: M500.G2 R500.2
NetM501_G2: M501.G2 R501.2
NetM502_G2: M502.G2 R502.2
NetR500_1: R500.1 U500.4(GATE)
NetR501_1: R501.1 U501.4(GATE)
NetR502_1: R502.1 U502.4(GATE)
NetU401_46: U500.3(~{SHDN}) ; port HTR_3_PWM
NetU401_61: U501.3(~{SHDN}) ; port HTR_2_PWM
NetU401_64: U502.3(~{SHDN}) ; port HTR_1_PWM

Not connected (* = marked no-connect by the designer): M500 D1* G1* S1*; M501 D1* G1* S1*; M502 D1* G1* S1*; U500 1(GDR)*; U501 1(GDR)*; U502 1(GDR)*

### Notes on the sheet
- (near J500) 6x1 Shrounded Male Header to Heaters
- (in symbol HeaterConnector) Heaters

### Library data of the parts
C500-C502 = C2012X8L1A106K125AE: 10 uF Capacitor; Supplier Part Number: C2012X8L1A106K125AE
D500 D502 D504 = STPS1L40ZF: 1A Schottky Diode; pin to pad: 1>C 2>A; Supplier 1: Mouser; Supplier Part Number 1: 511-STPS1L40ZF
J500 = HeaterConnector: Symbolic schematic symbol showing the inductance and resitance of the heaters
M500-M502 = SQJ208EP-T1_GE3: Two NPN Power Transistors for heater power control; Supplier 1: Mouser
R500-R502 = CRCW0603100RFKEAC: 100 Ohm Resistor; Supplier 1: Digi-Key; Supplier Part Number 1: 541-100HCT-ND
U500-U502 = CMP-0479-00408-1: Single and Dual Micropower High Side Switch Controller, 1.8 to 5.5 V Vin, 5-pin SOT23 (S5-5), -40 to 85 degC, Pb-Free, Mini Tape and Reel; Manufacturer: Analog Devices / Linear Technology; ComponentLink1URL: http://www.linear.com/; ComponentLink3Description: Package Specification; Packing: Mini Tape and Reel; PackageDescription: 5-Pin Plastic SOT-23, Body 1.625 x 2.90 mm, Pitch 0.95 mm; ComponentLink3URL: http://cds.linear.com/docs/en/datasheet/17278fb.pdf; PackageVersion: Aug-07; ComponentLink1Description: Manufacturer URL; PartNumber: LTC1981ES5#TRMPBF; RoHS: TRUE; ComponentLink2URL: http://cds.linear.com/docs/en/datasheet/19812fs.pdf; Mounting Technology: Surface Mount; PackageReference: S5-5; ComponentLink2Description: Datasheet; Manufacturer Part Number: LTC1981ES5#TRMPBF

## Sheet 200_CDH_USB_2_Hub.SchDoc
size A; Author: Tyler Sengia; Organization: SSPL; Revision: 1; SheetNumber: 1
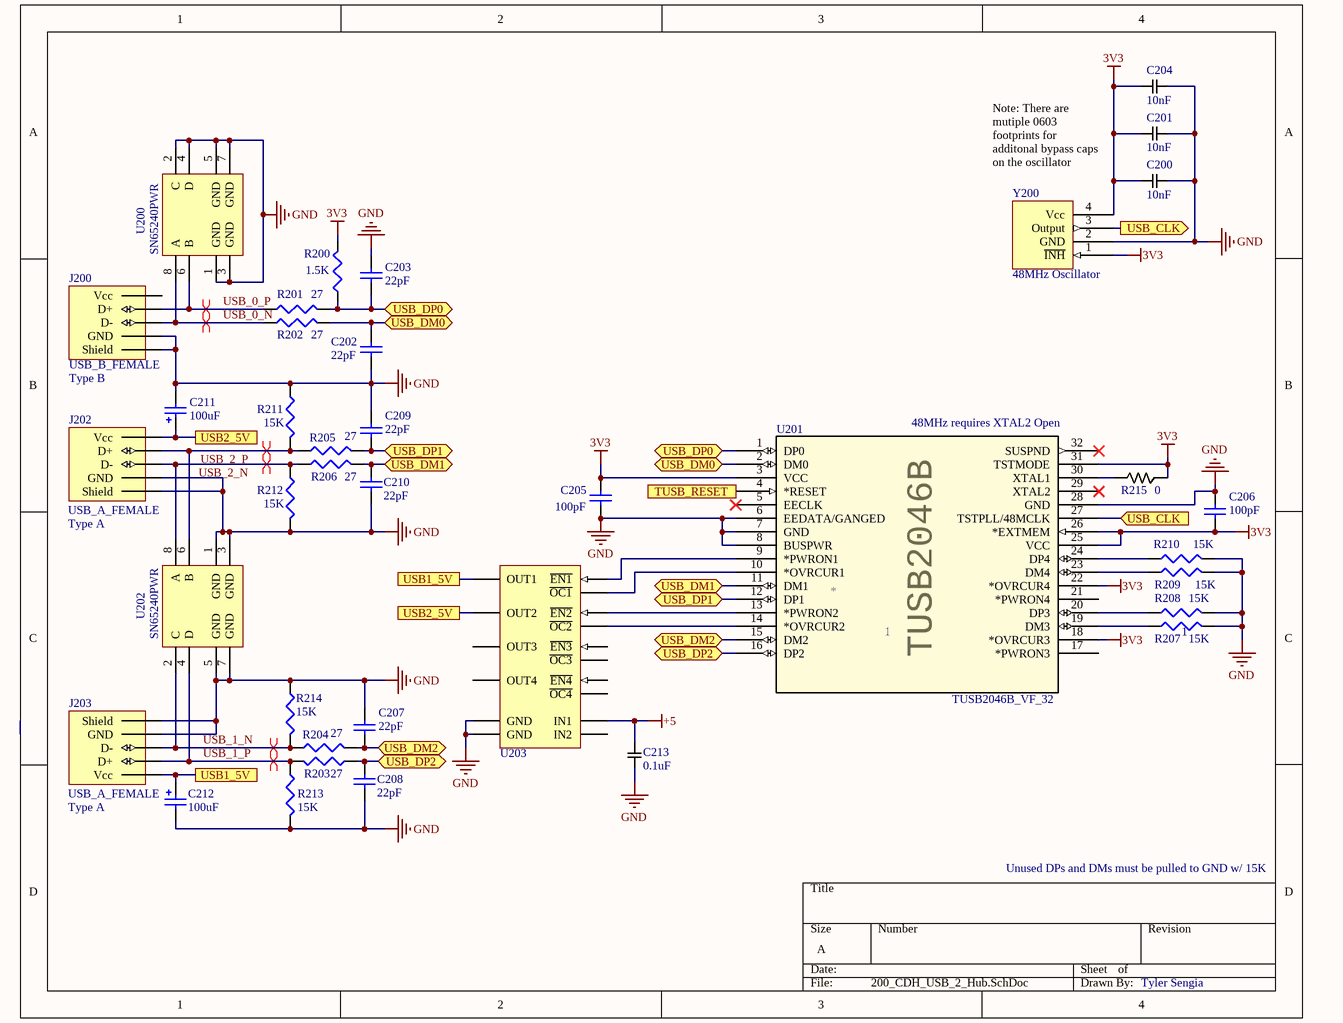
[diagram p5: 200_CDH_USB_2_Hub.SchDoc]

### Parts
C200  value 10nF  [IMPERIAL0603_Capacitor]  (hidden comment: 10nF Capacitor)
C201  value 10nF  [IMPERIAL0603_Capacitor]  (hidden comment: 10nF Capacitor)
C202  value 22pF  [IMPERIAL0805_CAPACITOR]  (hidden comment: 22pF capacitor)
C203  value 22pF  [IMPERIAL0805_CAPACITOR]  (hidden comment: 22pF capacitor)
C204  value 10nF  [IMPERIAL0603_Capacitor]  (hidden comment: 10nF Capacitor)
C205  value 100pF  [IMPERIAL0603_Capacitor]  (hidden comment: 100pF Capacitor)
C206  value 100pF  [IMPERIAL0603_Capacitor]  (hidden comment: 100pF Capacitor)
C207  value 22pF  [IMPERIAL0805_CAPACITOR]  (hidden comment: 22pF capacitor)
C208  value 22pF  [IMPERIAL0805_CAPACITOR]  (hidden comment: 22pF capacitor)
C209  value 22pF  [IMPERIAL0805_CAPACITOR]  (hidden comment: 22pF capacitor)
C210  value 22pF  [IMPERIAL0805_CAPACITOR]  (hidden comment: 22pF capacitor)
C211  value 100uF  [POLAR_CAP_SMD_EIA2010]  (hidden comment: F910J107MBAAJ6)
C212  value 100uF  [POLAR_CAP_SMD_EIA2010]  (hidden comment: F910J107MBAAJ6)
C213  value 0.1uF  [IMPERIAL0603_Capacitor]  (hidden comment: 0.1uF Capacitor)
J200  USB_B_FEMALE  USB Type: Type B  [USB_B_FEMALE_RT]
J202  USB_A_FEMALE  USB Type: Type A  [USB_A_FEMALE_SINGLE]
J203  USB_A_FEMALE  USB Type: Type A  [USB_A_FEMALE_SINGLE]
R200  value 1.5K  [Imperial0603_RES]  (hidden comment: 1.5KOhm Resistor)
R201  value 27  [Imperial0805_RES]  (hidden comment: 27 Ohm Resistor)
R202  value 27  [Imperial0805_RES]  (hidden comment: 27 Ohm Resistor)
R203  value 27  [Imperial0805_RES]  (hidden comment: 27 Ohm Resistor)
R204  value 27  [Imperial0805_RES]  (hidden comment: 27 Ohm Resistor)
R205  value 27  [Imperial0805_RES]  (hidden comment: 27 Ohm Resistor)
R206  value 27  [Imperial0805_RES]  (hidden comment: 27 Ohm Resistor)
R207  value 15K  [Imperial0603_RES]  (hidden comment: 15KOhm Resistor)
R208  value 15K  [Imperial0603_RES]  (hidden comment: 15KOhm Resistor)
R209  value 15K  [Imperial0603_RES]  (hidden comment: 15KOhm Resistor)
R210  value 15K  [Imperial0603_RES]  (hidden comment: 15KOhm Resistor)
R211  value 15K  [Imperial0603_RES]  (hidden comment: 15KOhm Resistor)
R212  value 15K  [Imperial0603_RES]  (hidden comment: 15KOhm Resistor)
R213  value 15K  [Imperial0603_RES]  (hidden comment: 15KOhm Resistor)
R214  value 15K  [Imperial0603_RES]  (hidden comment: 15KOhm Resistor)
R215  value 0  [Imperial0603_RES]  (hidden comment: 0 Ohm Link)
U200  SN65240PWR  [PW0008A_M]
U201  TUSB2046B_VF_32  GENERIC_PART_NUMBER: TUSB2046B  [TQFP80P900X900X160-32N]
U202  SN65240PWR  [PW0008A_M]
U203  TPS2044BDR  [D0016A_M_Local]  (value not drawn)
Y200  48MHz Oscillator  [KC3225-C3]

### Ports
TUSB_RESET (in), USB1_5V, USB2_5V, USB_CLK (in), USB_CLK (out), USB_DM0 (bidir), USB_DM1 (bidir), USB_DM2 (bidir), USB_DP0 (bidir), USB_DP1 (bidir), USB_DP2 (bidir)

### Nets
3V3: C200.2 C201.2 C204.2 C205.2 C206.1 R200.2 R215.2 U201.3(VCC) U201.18(*OVRCUR3) U201.22(*OVRCUR4) U201.25(VCC) U201.26(*EXTMEM) U201.31(TSTMODE) Y200.1(~{INH}) Y200.4(Vcc)
+5: C213.2 U203.2(IN1)
GND: C200.1 C201.1 C202.1 C203.2 C204.1 C205.1 C206.2 C207.1 C208.2 C209.1 C210.2 C211.2 C212.2 C213.1 J200.GND J200.Shield J202.GND J202.Shield J203.GND J203.Shield R207.2 R208.2 R209.2 R210.2 R211.1 R212.2 R213.1 R214.2 U200.1(GND) U200.2(C) U200.3(GND) U200.4(D) U200.5(GND) U200.7(GND) U201.6(EEDATA/GANGED) U201.7(GND) U201.8(BUSPWR) U201.28(GND) U202.1(GND) U202.3(GND) U202.5(GND) U202.7(GND) U203.1(GND) U203.5(GND) Y200.2(GND)
USB_0_N: J200.D- R202.1 U200.8(A)
USB_0_P: J200.D+ R201.1 U200.6(B)
USB_1_N: J203.D- R204.2 R214.1 U202.2(C)
USB_1_P: J203.D+ R203.1 R213.2 U202.4(D)
USB_2_N: J202.D- R206.1 R212.1 U202.8(A)
USB_2_P: J202.D+ R205.1 R211.2 U202.6(B)
NetC202_2: C202.2 R202.2 U201.2(DM0) ; port USB_DM0
NetC203_1: C203.1 R200.1 R201.2 U201.1(DP0) ; port USB_DP0
NetC207_2: C207.2 R204.1 U201.15(DM2) ; port USB_DM2
NetC208_1: C208.1 R203.2 U201.16(DP2) ; port USB_DP2
NetC209_2: C209.2 R205.2 U201.12(DP1) ; port USB_DP1
NetC210_1: C210.1 R206.2 U201.11(DM1) ; port USB_DM1
NetC211_1: C211.1 J202.Vcc U203.14(OUT2) ; port USB2_5V
NetC212_1: C212.1 J203.Vcc U203.15(OUT1) ; port USB1_5V
NetP9_12: U201.4(*RESET) ; port TUSB_RESET
NetR207_1: R207.1 U201.19(DM3)
NetR208_1: R208.1 U201.20(DP3)
NetR209_1: R209.1 U201.23(DM4)
NetR210_1: R210.1 U201.24(DP4)
NetR215_1: R215.1 U201.30(XTAL1)
NetU201_9: U201.9(*PWRON1) U203.3(~{EN1})
NetU201_10: U201.10(*OVRCUR1) U203.16(~{OC1})
NetU201_13: U201.13(*PWRON2) U203.4(~{EN2})
NetU201_14: U201.14(*OVRCUR2) U203.13(~{OC2})
NetU201_27: U201.27(TSTPLL/48MCLK) Y200.3(Output) ; port USB_CLK

Not connected (* = marked no-connect by the designer): J200 Vcc; U201 5(EECLK)* 17(*PWRON3) 21(*PWRON4) 29(XTAL2)* 32(SUSPND)*; U203 6(IN2) 7(~{EN3}) 8(~{EN4}) 9(~{OC4}) 10(OUT4) 11(OUT3) 12(~{OC3})

### Layout directives
differential pair; rule Impedance Constraint [Min = 81.00    Max = 99.00    ]: USB_0_N, USB_0_P, USB_1_N, USB_1_P, USB_2_N, USB_2_P

### Notes on the sheet
- Note: There are mutiple 0603 footprints for additonal bypass caps on the oscillator
- (near U201) 48MHz requires XTAL2 Open
- Unused DPs and DMs must be pulled to GND w/ 15K

### Library data of the parts
C200 C201 C204 = 06033C103J4Z2A: 10nF Capacitor for crystal oscillator; Manufacturer: AVX; Supplier Part Number: 581-06033C103J4Z2A; Supplier: Mouser; Manufacturer Part Number: 06033C103J4Z2A
C202 C203 C207-C210 = C0805X220K3GACAUTO: 22pF USB Filter Capacitor; Published: 8-Jun-2000; LatestRevisionDate: 29-May-2009; LatestRevisionNote: IPC-7351 Footprint Added.; PackageReference: C1206; Publisher: Altium Limited; PackageDescription: Chip Capacitor; Supplier 1: Digi-Key; Supplier Part Number 1: 399-19450-1-ND
C205 C206 = C0603C101K8HAUTO: 100pF Cap for IC Vcc Smoothing; Published: 8-Jun-2000; LatestRevisionDate: 29-May-2009; LatestRevisionNote: IPC-7351 Footprint Added.; PackageReference: C1206; Publisher: Altium Limited; PackageDescription: Chip Capacitor; Supplier 1: Mouser; Supplier Part Number 1: 80-C0603C101K8HAUTO
C211 C212 = F910J107MBAAJ6: 100uF, USB Power smoothing capacitor, tantalium, low ESR; Published: 8-Jun-2000; LatestRevisionDate: 29-May-2009; LatestRevisionNote: IPC-7351 Footprint Added.; PackageReference: C0805; Publisher: Altium Limited; PackageDescription: Chip Capacitor; Supplier 1: Digi-Key; Supplier Part Number 1: 478-12526-1-ND
C213 = VJ0603Y104MXQPW1BC: 0.1uF Capacitor, Non Polarized Chip Cap; Supplier 1: Mouser; Supplier Part Number 1: 963-LMK107BJ225KK-T
J200 = USB_B_FEMALE: USB Type B female connector.; Supplier 1: Digi-Key; Supplier Part Number 1: 380-1492-ND
J202 J203 = USB_A_FEMALE: USB Type A female connector.; Supplier 1: Digi-Key; Supplier Part Number 1: 732-10012-ND
R200 = ERJ-S03D1501V: 1.5KOhm Resistor, for USB pull up; Published: 8-Jun-2000; LatestRevisionDate: 29-May-2009; LatestRevisionNote: IPC-7351 Footprint Added.; PackageReference: J1-0603; Publisher: Altium Limited; PackageDescription: Chip Resistor; Supplier 1: Mouser; Supplier Part Number 1: 667-ERJ-S03D1501V
R201-R206 = CR0805-FX-27R0ELF: 27Ohm Resitor, USB Terminating Resistor; Published: 8-Jun-2000; LatestRevisionDate: 29-May-2009; LatestRevisionNote: IPC-7351 Footprint Added.; PackageReference: J1-0603; Publisher: Altium Limited; PackageDescription: Chip Resistor; Supplier 1: Mouser; Supplier Part Number 1: 652-CR0805FX-27R0ELF
R207-R214 = CRCW060315K0JNEAC: 15KOhm Resistor, for USB pull down; Published: 8-Jun-2000; LatestRevisionDate: 29-May-2009; LatestRevisionNote: IPC-7351 Footprint Added.; PackageReference: J1-0603; Publisher: Altium Limited; PackageDescription: Chip Resistor; Supplier 1: Digi-Key; Supplier Part Number 1: 541-15KGCT-ND
R215 = 0_Ohm_Link: Placeholder 0 Ohm Link.
U200 U202 = CMP-0326-00072-3: Universal Serial Bus Port Transient Suppressor, 4 Channels, -40 to +85 degC, 8-pin TSSOP (PW), Green (RoHS & no Sb/Br); Manufacturer: Texas Instruments; IO Capacitance(Typ)(pF): 35; Breakdown Voltage(Min)(V): 7; USB Full Speed: TRUE; SubFamily: ESD Solution; Eco-Plan: Pb-Free (RoHS); IO Leakage Current(nA): 1000; Mounting Technology: Surface Mount; ComponentLink3Description: URL Link1; PackageDescription: 8-Pin Plastic Thin Small Outline Package 3 x 4.4 mm Body ,0.65 mm Pitch; DatasheetVersion: SLLS266G; PackageVersion: revG, Feb-2011; ComponentLink2URL: http://www.ti.com/general/docs/lit/getliterature.tsp?genericPartNumber=SN65240&fileType=pdf; ComponentLink2Description: Datasheet; ComponentLink1URL: http://www.ti.com/; ComponentLink3URL: SamplesURL:http://www.ti.com/product/sn65240#samples; PackageReference: PW0008A; ComponentLink1Description: Manufacturer URL; PartNumber: SN65240PWR; Manufacturer Part Number: SN65240PWR
U201 = TUSB2046B_VF_32: USB 2.0 Hub IC; Vendor: Texas Instruments; PACKAGE_DESIGNATOR: VF; PIN_COUNT: 32; FAMILY_NAME: USB HUB CONTROLLER; INDUSTRY_STD_PKG_TYPE: LQFP; Manufacturer_Part_Number: tusb2046b_vf_32; Manufacturer: Texas Instruments; Datasheet_URL: http://www.ti.com/lit/gpn/TUSB2046B; Value: Value; Type: Type; RefDes: RefDes; Supplier 1: Digi-Key; Supplier Part Number 1: 296-48218-1-ND
U203 = TITPS10244BD1: Quad Current-Limited Power Distribution Switch, 1 A Current Limit, -40 to 85 degC, 16-pin SOIC (D), Green (RoHS & no Sb/Br); Manufacturer: Texas Instruments; ComponentLink1Description: datasheet; ComponentLink1URL: http://www.ti.com/general/docs/lit/getliterature.tsp?genericPartNumber=TPS2044B&fileType=pdf
Y200 = KC3225A-C3: 48MHz crystal oscillator

## Nets that join several sheets
3V3: 300_CDH_RS422 (7 pins), 000_BBB_Pinouts (U1.5 U2.20), 100_POWER (C107.2 C108.2 C109.2 VR103.1), 200_CDH_USB_2_Hub (15 pins)
+5: 000_BBB_Pinouts (P9.5 P9.6 R10.1), 100_POWER (C110.2 R102.1 VR100.3 VR103.3), 400_TEENSY (P400.2), 500_HEATERS (6 pins), 200_CDH_USB_2_Hub (C213.2 U203.2)
+28: 000_BBB_Pinouts (J1.1 J1.2 J1.4 J1.6), 100_POWER (6 pins), 500_HEATERS (6 pins)
GND: 300_CDH_RS422 (9 pins), 000_BBB_Pinouts (15 pins), 100_POWER (17 pins), 400_TEENSY (18 pins), 500_HEATERS (9 pins), 200_CDH_USB_2_Hub (45 pins)
NetC407_2: 000_BBB_Pinouts (9 pins), 400_TEENSY (6 pins)
NetJ1_21: 000_BBB_Pinouts (J1.21), 400_TEENSY (U401.60)
NetJ1_23: 000_BBB_Pinouts (J1.23), 400_TEENSY (U401.59)
NetJ1_24: 000_BBB_Pinouts (J1.24), 400_TEENSY (U401.2)
NetM103_1: 000_BBB_Pinouts (U2.12), 100_POWER (M103.1)
NetP9_12: 000_BBB_Pinouts (P9.12), 200_CDH_USB_2_Hub (U201.4)
NetP9_39: 000_BBB_Pinouts (P9.39), 100_POWER (R100.2 R101.1)
NetR1_1: 000_BBB_Pinouts (R1.1 RT1.1), 400_TEENSY (U401.58)
NetR2_1: 000_BBB_Pinouts (R2.1 RT1.3), 400_TEENSY (U401.43)
NetR3_1: 000_BBB_Pinouts (R3.1 RT1.5), 400_TEENSY (U401.35)
NetR4_1: 000_BBB_Pinouts (R4.1 RT1.7), 400_TEENSY (U401.36)
NetR5_2: 000_BBB_Pinouts (R5.2 RT1.9), 400_TEENSY (U401.38)
NetR6_1: 000_BBB_Pinouts (R6.1 RT1.11), 400_TEENSY (U401.37)
NetR7_1: 000_BBB_Pinouts (R7.1 RT1.13), 400_TEENSY (U401.62)
NetR8_1: 000_BBB_Pinouts (R8.1 RT1.15), 400_TEENSY (U401.63)
NetR9_1: 000_BBB_Pinouts (R9.1 RT1.17), 400_TEENSY (U401.44)
NetU2_14: 300_CDH_RS422 (U300.5), 000_BBB_Pinouts (U2.14)
NetU2_15: 300_CDH_RS422 (U300.2), 000_BBB_Pinouts (U2.15)
NetU2_16: 000_BBB_Pinouts (U2.16), 400_TEENSY (U401.39)
NetU2_17: 000_BBB_Pinouts (U2.17), 400_TEENSY (U401.40)
NetU401_46: 400_TEENSY (U401.46), 500_HEATERS (U500.3)
NetU401_61: 400_TEENSY (U401.61), 500_HEATERS (U501.3)
NetU401_64: 400_TEENSY (U401.64), 500_HEATERS (U502.3)
RS422-Rx_N: 300_CDH_RS422 (D300.1 R301.2 R302.2), 000_BBB_Pinouts (J1.11)
RS422-Rx_P: 300_CDH_RS422 (D300.2 R300.2 R301.1), 000_BBB_Pinouts (J1.9)
RS422-Tx_N: 300_CDH_RS422 (D301.2 R303.2 R305.2), 000_BBB_Pinouts (J1.13)
RS422-Tx_P: 300_CDH_RS422 (D301.1 R304.2 R305.1), 000_BBB_Pinouts (J1.15)
TN_3V3: 000_BBB_Pinouts (9 pins), 400_TEENSY (12 pins)

## Assembly variants
Default: all parts fitted